# Altium schematic sheet Gastroscopy-Tool-Sensor_Overview.SchDoc: Overview
size 279 x 215 mm; Date: not used; ApprovedBy: not used; CheckedBy: not used; Author: not used; DrawnBy: not used; Organization: not used; Address4: not used; SheetNumber: 2; SheetTotal: 5; Time: not used; ImagePath: not used; Application_BuildNumber: not used
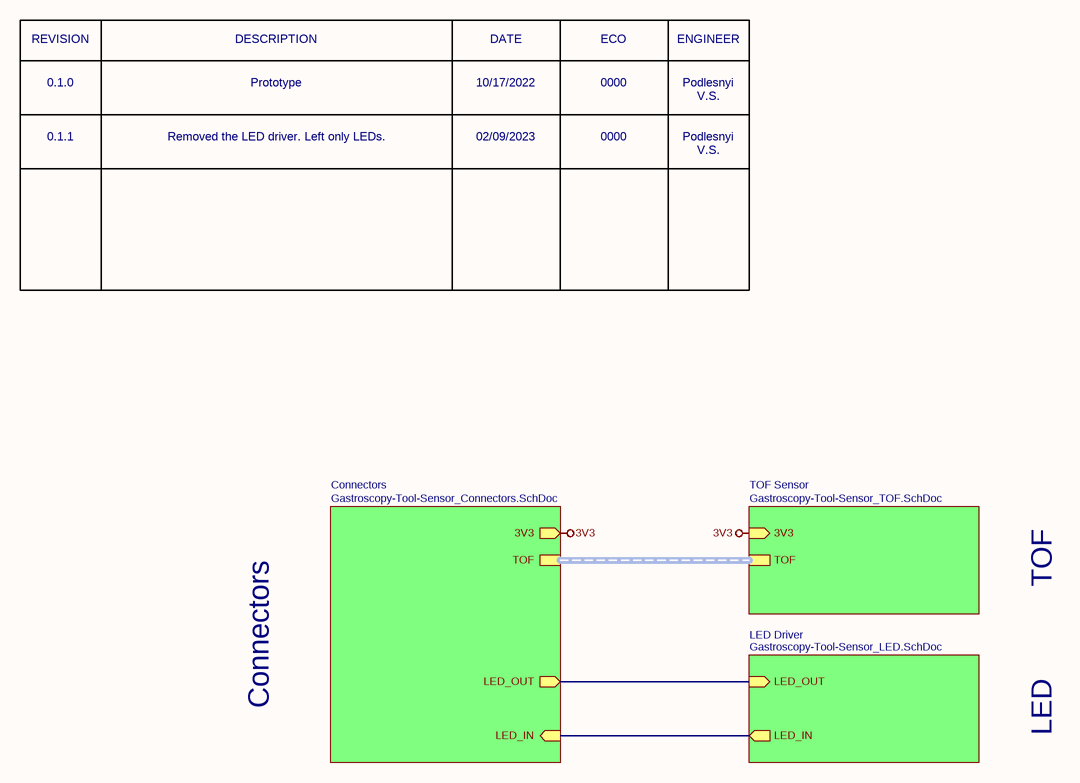
[diagram p0: Gastroscopy-Tool-Sensor_Overview.SchDoc]

## Sub-sheets
Connectors = Gastroscopy-Tool-Sensor_Connectors.SchDoc: TOF (harness TOF), LED_IN (in), LED_OUT (out), 3V3 (out)
LED Driver = Gastroscopy-Tool-Sensor_LED.SchDoc: LED_OUT (in), LED_IN (out)
TOF Sensor = Gastroscopy-Tool-Sensor_TOF.SchDoc: 3V3 (in), TOF (harness TOF)

## Nets
3V3: sheet TOF Sensor/3V3, sheet Connectors/3V3
(unnamed): sheet LED Driver/LED_OUT, sheet Connectors/LED_OUT
(unnamed): sheet LED Driver/LED_IN, sheet Connectors/LED_IN

## Buses and harness runs
harness sheet Connectors/TOF = sheet TOF Sensor/TOF

## Notes on the sheet
- REVISION
- DESCRIPTION
- DATE
- ECO
- ENGINEER
- 0.1.0
- Prototype
- 10/17/2022
- 0000
- Podlesnyi V.S.
- 0.1.1
- Removed the LED driver. Left only LEDs.
- 02/09/2023
- TOF
- Connectors
- LED
- Title:
- Date:
- Size A
- Project:
- Number:
- Time:
- Sheet
- Revision
- of
- Engineer:
- www.mrobots.ru <http://mrobots.ru/>
- File: